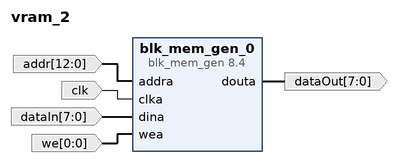
[diagram p0: block diagram of the top level]
# Vivado block design vram_2, xc7a100tcsg324-1, Vivado 2020.2
create_bd_design vram_2

create_bd_port -dir I -from 12 -to 0 addr
create_bd_port -dir O -from 7 -to 0 dataOut
create_bd_port -dir I clk
create_bd_port -dir I -from 7 -to 0 dataIn
create_bd_port -dir I -from 0 -to 0 we

create_bd_cell -type ip -vlnv xilinx.com:ip:blk_mem_gen:8.4 blk_mem_gen_0
set_property -dict [list \
  CONFIG.Coe_File ../../../../../../../avg_clean2.coe \
  CONFIG.Enable_32bit_Address false \
  CONFIG.Enable_A Always_Enabled \
  CONFIG.Load_Init_File true \
  CONFIG.Read_Width_A 8 \
  CONFIG.Register_PortA_Output_of_Memory_Primitives false \
  CONFIG.Use_Byte_Write_Enable false \
  CONFIG.Use_RSTA_Pin false \
  CONFIG.Write_Width_A 8 \
  CONFIG.use_bram_block Stand_Alone \
] [get_bd_cells blk_mem_gen_0]

# ---- connections ----

connect_bd_net [get_bd_ports addr] [get_bd_pins blk_mem_gen_0/addra]
connect_bd_net [get_bd_pins blk_mem_gen_0/douta] [get_bd_ports dataOut]
connect_bd_net [get_bd_ports clk] [get_bd_pins blk_mem_gen_0/clka]
connect_bd_net [get_bd_ports dataIn] [get_bd_pins blk_mem_gen_0/dina]
connect_bd_net [get_bd_ports we] [get_bd_pins blk_mem_gen_0/wea]

validate_bd_design
save_bd_design
